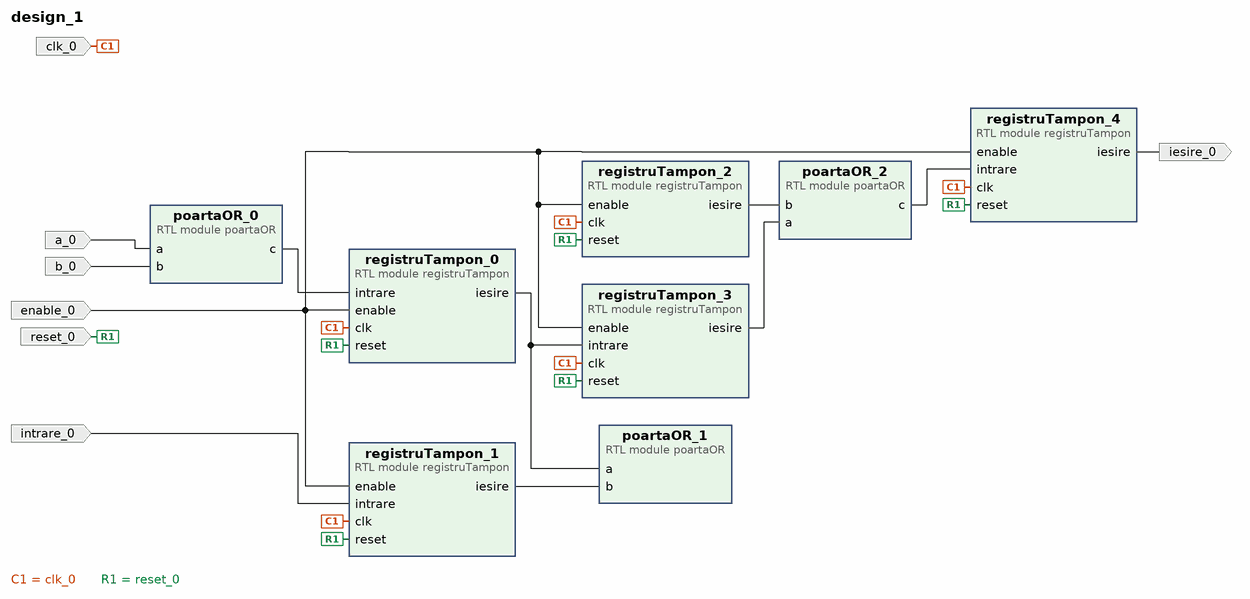
[diagram p0: block diagram of the top level]
# Vivado block design design_1, xc7a100tcsg324-1, Vivado 2020.2
create_bd_design design_1

create_bd_port -dir I -type clk clk_0
create_bd_port -dir I enable_0
create_bd_port -dir I intrare_0
create_bd_port -dir I -type rst reset_0
create_bd_port -dir I a_0
create_bd_port -dir I b_0
create_bd_port -dir O iesire_0

create_bd_cell -type module -reference poartaOR poartaOR_0
create_bd_cell -type module -reference registruTampon registruTampon_0
create_bd_cell -type module -reference registruTampon registruTampon_1
create_bd_cell -type module -reference poartaOR poartaOR_1
create_bd_cell -type module -reference registruTampon registruTampon_2
create_bd_cell -type module -reference registruTampon registruTampon_3
create_bd_cell -type module -reference poartaOR poartaOR_2
create_bd_cell -type module -reference registruTampon registruTampon_4

# ---- connections ----

connect_bd_net [get_bd_pins poartaOR_0/c] [get_bd_pins registruTampon_0/intrare]
connect_bd_net -net clk_0_1 [get_bd_ports clk_0] \
  [get_bd_pins registruTampon_1/clk] [get_bd_pins registruTampon_0/clk] [get_bd_pins registruTampon_3/clk] \
  [get_bd_pins registruTampon_2/clk] [get_bd_pins registruTampon_4/clk]
connect_bd_net -net enable_0_1 [get_bd_ports enable_0] \
  [get_bd_pins registruTampon_1/enable] [get_bd_pins registruTampon_0/enable] [get_bd_pins registruTampon_3/enable] \
  [get_bd_pins registruTampon_2/enable] [get_bd_pins registruTampon_4/enable]
connect_bd_net -net reset_0_1 [get_bd_ports reset_0] \
  [get_bd_pins registruTampon_1/reset] [get_bd_pins registruTampon_0/reset] [get_bd_pins registruTampon_3/reset] \
  [get_bd_pins registruTampon_2/reset] [get_bd_pins registruTampon_4/reset]
connect_bd_net -net a_0_1 [get_bd_ports a_0] [get_bd_pins poartaOR_0/a]
connect_bd_net -net b_0_1 [get_bd_ports b_0] [get_bd_pins poartaOR_0/b]
connect_bd_net -net intrare_0_1 [get_bd_ports intrare_0] [get_bd_pins registruTampon_1/intrare]
connect_bd_net [get_bd_pins registruTampon_1/iesire] [get_bd_pins poartaOR_1/b]
connect_bd_net [get_bd_pins registruTampon_0/iesire] [get_bd_pins poartaOR_1/a] [get_bd_pins registruTampon_3/intrare]
connect_bd_net [get_bd_pins registruTampon_3/iesire] [get_bd_pins poartaOR_2/a]
connect_bd_net [get_bd_pins registruTampon_2/iesire] [get_bd_pins poartaOR_2/b]
connect_bd_net [get_bd_pins poartaOR_2/c] [get_bd_pins registruTampon_4/intrare]
connect_bd_net [get_bd_pins registruTampon_4/iesire] [get_bd_ports iesire_0]

validate_bd_design
save_bd_design
